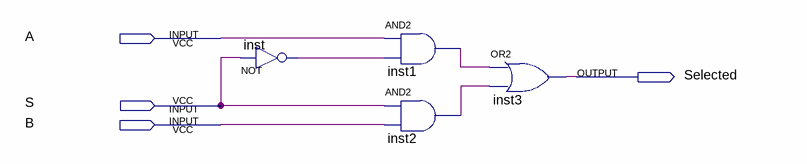
[diagram p0: schematic sheet]
// Quartus schematic Mux2_1.bdf as structural Verilog: 4 symbols, 4 pins
module Mux2_1 (
  input  A,
  input  S,
  input  B,
  output Selected
);

  wire inst1_out, inst2_out, inst_out;

  not inst (inst_out, S);
  and inst1 (inst1_out, A, inst_out);
  and inst2 (inst2_out, S, B);
  or inst3 (Selected, inst1_out, inst2_out);
endmodule
